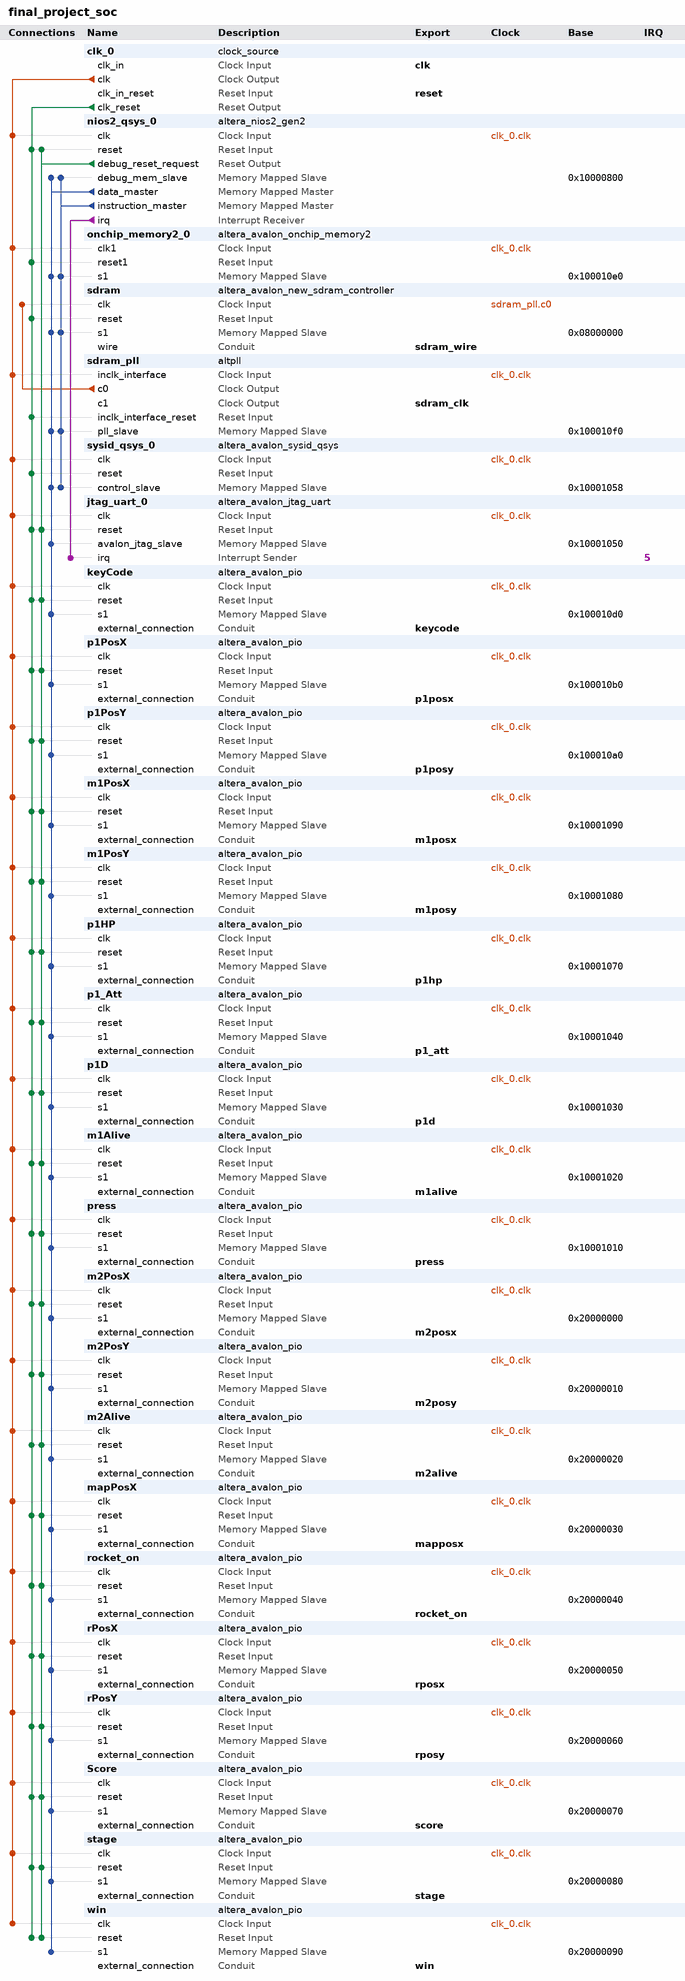
[diagram p0: system contents]
# Platform Designer (Qsys) system final_project_soc, Cyclone IV E EP4CE115F29C7
# Parameters at their usual value, and those the tool derives, are not listed.
package require -exact qsys 15.0
create_system final_project_soc
set_project_property DEVICE_FAMILY {Cyclone IV E}
set_project_property DEVICE EP4CE115F29C7

add_instance clk_0 clock_source 15.0
set_instance_parameter_value clk_0 clockFrequency 50000000

add_instance nios2_qsys_0 altera_nios2_gen2 15.0
set_instance_parameter_value nios2_qsys_0 dcache_size 2048
set_instance_parameter_value nios2_qsys_0 exceptionSlave sdram.s1
set_instance_parameter_value nios2_qsys_0 icache_size 4096
set_instance_parameter_value nios2_qsys_0 impl Tiny
set_instance_parameter_value nios2_qsys_0 resetSlave sdram.s1

add_instance onchip_memory2_0 altera_avalon_onchip_memory2 15.0
set_instance_parameter_value onchip_memory2_0 dataWidth 32
set_instance_parameter_value onchip_memory2_0 dualPort false
set_instance_parameter_value onchip_memory2_0 initMemContent true
set_instance_parameter_value onchip_memory2_0 initializationFileName onchip_mem.hex
set_instance_parameter_value onchip_memory2_0 memorySize 16

add_instance sdram altera_avalon_new_sdram_controller 15.0
set_instance_parameter_value sdram TAC 5.5
set_instance_parameter_value sdram TRCD 20.0
set_instance_parameter_value sdram TRP 20.0
set_instance_parameter_value sdram casLatency 3
set_instance_parameter_value sdram columnWidth 10
set_instance_parameter_value sdram dataWidth 32
set_instance_parameter_value sdram generateSimulationModel false
set_instance_parameter_value sdram model single_Micron_MT48LC4M32B2_7_chip
set_instance_parameter_value sdram numberOfBanks 4
set_instance_parameter_value sdram numberOfChipSelects 1
set_instance_parameter_value sdram powerUpDelay 200.0
set_instance_parameter_value sdram refreshPeriod 7.8125
set_instance_parameter_value sdram rowWidth 13

add_instance sdram_pll altpll 15.0
set_instance_parameter_value sdram_pll CLK0_DIVIDE_BY 1
set_instance_parameter_value sdram_pll CLK0_MULTIPLY_BY 1
set_instance_parameter_value sdram_pll CLK1_DIVIDE_BY 1
set_instance_parameter_value sdram_pll CLK1_DUTY_CYCLE 50
set_instance_parameter_value sdram_pll CLK1_MULTIPLY_BY 1
set_instance_parameter_value sdram_pll CLK1_PHASE_SHIFT -3000
set_instance_parameter_value sdram_pll INCLK0_INPUT_FREQUENCY 20000
set_instance_parameter_value sdram_pll PORT_ARESET PORT_UNUSED
set_instance_parameter_value sdram_pll PORT_LOCKED PORT_UNUSED
set_instance_parameter_value sdram_pll PORT_clk1 PORT_USED
set_instance_parameter_value sdram_pll PORT_clk2 PORT_UNUSED
set_instance_parameter_value sdram_pll PORT_clk3 PORT_UNUSED

add_instance sysid_qsys_0 altera_avalon_sysid_qsys 15.0
set_instance_parameter_value sysid_qsys_0 id 0

add_instance jtag_uart_0 altera_avalon_jtag_uart 15.0
set_instance_parameter_value jtag_uart_0 simInteractiveOptions NO_INTERACTIVE_WINDOWS

add_instance keyCode altera_avalon_pio 15.0
set_instance_parameter_value keyCode direction Input
set_instance_parameter_value keyCode width 8

add_instance p1PosX altera_avalon_pio 15.0
set_instance_parameter_value p1PosX direction Output
set_instance_parameter_value p1PosX width 12

add_instance p1PosY altera_avalon_pio 15.0
set_instance_parameter_value p1PosY direction Output
set_instance_parameter_value p1PosY width 10

add_instance m1PosX altera_avalon_pio 15.0
set_instance_parameter_value m1PosX direction Output
set_instance_parameter_value m1PosX width 12

add_instance m1PosY altera_avalon_pio 15.0
set_instance_parameter_value m1PosY direction Output
set_instance_parameter_value m1PosY width 10

add_instance p1HP altera_avalon_pio 15.0
set_instance_parameter_value p1HP direction Output
set_instance_parameter_value p1HP width 3

add_instance p1_Att altera_avalon_pio 15.0
set_instance_parameter_value p1_Att direction Output
set_instance_parameter_value p1_Att width 1

add_instance p1D altera_avalon_pio 15.0
set_instance_parameter_value p1D direction Output
set_instance_parameter_value p1D width 1

add_instance m1Alive altera_avalon_pio 15.0
set_instance_parameter_value m1Alive direction Output
set_instance_parameter_value m1Alive width 1

add_instance press altera_avalon_pio 15.0
set_instance_parameter_value press direction Input
set_instance_parameter_value press width 1

add_instance m2PosX altera_avalon_pio 15.0
set_instance_parameter_value m2PosX direction Output
set_instance_parameter_value m2PosX width 12

add_instance m2PosY altera_avalon_pio 15.0
set_instance_parameter_value m2PosY direction Output
set_instance_parameter_value m2PosY width 10

add_instance m2Alive altera_avalon_pio 15.0
set_instance_parameter_value m2Alive direction Output
set_instance_parameter_value m2Alive width 1

add_instance mapPosX altera_avalon_pio 15.0
set_instance_parameter_value mapPosX direction Output
set_instance_parameter_value mapPosX width 12

add_instance rocket_on altera_avalon_pio 15.0
set_instance_parameter_value rocket_on direction Output
set_instance_parameter_value rocket_on width 1

add_instance rPosX altera_avalon_pio 15.0
set_instance_parameter_value rPosX direction Output
set_instance_parameter_value rPosX width 12

add_instance rPosY altera_avalon_pio 15.0
set_instance_parameter_value rPosY direction Output
set_instance_parameter_value rPosY width 10

add_instance Score altera_avalon_pio 15.0
set_instance_parameter_value Score direction Output
set_instance_parameter_value Score width 5

add_instance stage altera_avalon_pio 15.0
set_instance_parameter_value stage direction Output
set_instance_parameter_value stage width 2

add_instance win altera_avalon_pio 15.0
set_instance_parameter_value win direction Output
set_instance_parameter_value win width 1

# connections
add_connection clk_0.clk jtag_uart_0.clk clock
add_connection clk_0.clk keyCode.clk clock
add_connection clk_0.clk m1Alive.clk clock
add_connection clk_0.clk m1PosX.clk clock
add_connection clk_0.clk m1PosY.clk clock
add_connection clk_0.clk m2Alive.clk clock
add_connection clk_0.clk m2PosX.clk clock
add_connection clk_0.clk m2PosY.clk clock
add_connection clk_0.clk mapPosX.clk clock
add_connection clk_0.clk nios2_qsys_0.clk clock
add_connection clk_0.clk onchip_memory2_0.clk1 clock
add_connection clk_0.clk p1_Att.clk clock
add_connection clk_0.clk p1D.clk clock
add_connection clk_0.clk p1HP.clk clock
add_connection clk_0.clk p1PosX.clk clock
add_connection clk_0.clk p1PosY.clk clock
add_connection clk_0.clk press.clk clock
add_connection clk_0.clk rocket_on.clk clock
add_connection clk_0.clk rPosX.clk clock
add_connection clk_0.clk rPosY.clk clock
add_connection clk_0.clk Score.clk clock
add_connection clk_0.clk sdram_pll.inclk_interface clock
add_connection clk_0.clk stage.clk clock
add_connection clk_0.clk sysid_qsys_0.clk clock
add_connection clk_0.clk win.clk clock
add_connection sdram_pll.c0 sdram.clk clock
add_connection clk_0.clk_reset jtag_uart_0.reset reset
add_connection clk_0.clk_reset keyCode.reset reset
add_connection clk_0.clk_reset m1Alive.reset reset
add_connection clk_0.clk_reset m1PosX.reset reset
add_connection clk_0.clk_reset m1PosY.reset reset
add_connection clk_0.clk_reset m2Alive.reset reset
add_connection clk_0.clk_reset m2PosX.reset reset
add_connection clk_0.clk_reset m2PosY.reset reset
add_connection clk_0.clk_reset mapPosX.reset reset
add_connection clk_0.clk_reset nios2_qsys_0.reset reset
add_connection clk_0.clk_reset onchip_memory2_0.reset1 reset
add_connection clk_0.clk_reset p1_Att.reset reset
add_connection clk_0.clk_reset p1D.reset reset
add_connection clk_0.clk_reset p1HP.reset reset
add_connection clk_0.clk_reset p1PosX.reset reset
add_connection clk_0.clk_reset p1PosY.reset reset
add_connection clk_0.clk_reset press.reset reset
add_connection clk_0.clk_reset rocket_on.reset reset
add_connection clk_0.clk_reset rPosX.reset reset
add_connection clk_0.clk_reset rPosY.reset reset
add_connection clk_0.clk_reset Score.reset reset
add_connection clk_0.clk_reset sdram.reset reset
add_connection clk_0.clk_reset sdram_pll.inclk_interface_reset reset
add_connection clk_0.clk_reset stage.reset reset
add_connection clk_0.clk_reset sysid_qsys_0.reset reset
add_connection clk_0.clk_reset win.reset reset
add_connection nios2_qsys_0.debug_reset_request jtag_uart_0.reset reset
add_connection nios2_qsys_0.debug_reset_request keyCode.reset reset
add_connection nios2_qsys_0.debug_reset_request m1Alive.reset reset
add_connection nios2_qsys_0.debug_reset_request m1PosX.reset reset
add_connection nios2_qsys_0.debug_reset_request m1PosY.reset reset
add_connection nios2_qsys_0.debug_reset_request m2Alive.reset reset
add_connection nios2_qsys_0.debug_reset_request m2PosX.reset reset
add_connection nios2_qsys_0.debug_reset_request m2PosY.reset reset
add_connection nios2_qsys_0.debug_reset_request mapPosX.reset reset
add_connection nios2_qsys_0.debug_reset_request nios2_qsys_0.reset reset
add_connection nios2_qsys_0.debug_reset_request p1_Att.reset reset
add_connection nios2_qsys_0.debug_reset_request p1D.reset reset
add_connection nios2_qsys_0.debug_reset_request p1HP.reset reset
add_connection nios2_qsys_0.debug_reset_request p1PosX.reset reset
add_connection nios2_qsys_0.debug_reset_request p1PosY.reset reset
add_connection nios2_qsys_0.debug_reset_request press.reset reset
add_connection nios2_qsys_0.debug_reset_request rocket_on.reset reset
add_connection nios2_qsys_0.debug_reset_request rPosX.reset reset
add_connection nios2_qsys_0.debug_reset_request rPosY.reset reset
add_connection nios2_qsys_0.debug_reset_request Score.reset reset
add_connection nios2_qsys_0.debug_reset_request stage.reset reset
add_connection nios2_qsys_0.debug_reset_request win.reset reset
add_connection nios2_qsys_0.data_master jtag_uart_0.avalon_jtag_slave avalon
set_connection_parameter_value nios2_qsys_0.data_master/jtag_uart_0.avalon_jtag_slave baseAddress 0x10001050
add_connection nios2_qsys_0.data_master keyCode.s1 avalon
set_connection_parameter_value nios2_qsys_0.data_master/keyCode.s1 baseAddress 0x100010d0
add_connection nios2_qsys_0.data_master m1Alive.s1 avalon
set_connection_parameter_value nios2_qsys_0.data_master/m1Alive.s1 baseAddress 0x10001020
add_connection nios2_qsys_0.data_master m1PosX.s1 avalon
set_connection_parameter_value nios2_qsys_0.data_master/m1PosX.s1 baseAddress 0x10001090
add_connection nios2_qsys_0.data_master m1PosY.s1 avalon
set_connection_parameter_value nios2_qsys_0.data_master/m1PosY.s1 baseAddress 0x10001080
add_connection nios2_qsys_0.data_master m2Alive.s1 avalon
set_connection_parameter_value nios2_qsys_0.data_master/m2Alive.s1 baseAddress 0x20000020
add_connection nios2_qsys_0.data_master m2PosX.s1 avalon
set_connection_parameter_value nios2_qsys_0.data_master/m2PosX.s1 baseAddress 0x20000000
add_connection nios2_qsys_0.data_master m2PosY.s1 avalon
set_connection_parameter_value nios2_qsys_0.data_master/m2PosY.s1 baseAddress 0x20000010
add_connection nios2_qsys_0.data_master mapPosX.s1 avalon
set_connection_parameter_value nios2_qsys_0.data_master/mapPosX.s1 baseAddress 0x20000030
add_connection nios2_qsys_0.data_master nios2_qsys_0.debug_mem_slave avalon
set_connection_parameter_value nios2_qsys_0.data_master/nios2_qsys_0.debug_mem_slave baseAddress 0x10000800
add_connection nios2_qsys_0.data_master onchip_memory2_0.s1 avalon
set_connection_parameter_value nios2_qsys_0.data_master/onchip_memory2_0.s1 baseAddress 0x100010e0
add_connection nios2_qsys_0.data_master p1_Att.s1 avalon
set_connection_parameter_value nios2_qsys_0.data_master/p1_Att.s1 baseAddress 0x10001040
add_connection nios2_qsys_0.data_master p1D.s1 avalon
set_connection_parameter_value nios2_qsys_0.data_master/p1D.s1 baseAddress 0x10001030
add_connection nios2_qsys_0.data_master p1HP.s1 avalon
set_connection_parameter_value nios2_qsys_0.data_master/p1HP.s1 baseAddress 0x10001070
add_connection nios2_qsys_0.data_master p1PosX.s1 avalon
set_connection_parameter_value nios2_qsys_0.data_master/p1PosX.s1 baseAddress 0x100010b0
add_connection nios2_qsys_0.data_master p1PosY.s1 avalon
set_connection_parameter_value nios2_qsys_0.data_master/p1PosY.s1 baseAddress 0x100010a0
add_connection nios2_qsys_0.data_master press.s1 avalon
set_connection_parameter_value nios2_qsys_0.data_master/press.s1 baseAddress 0x10001010
add_connection nios2_qsys_0.data_master rocket_on.s1 avalon
set_connection_parameter_value nios2_qsys_0.data_master/rocket_on.s1 baseAddress 0x20000040
add_connection nios2_qsys_0.data_master rPosX.s1 avalon
set_connection_parameter_value nios2_qsys_0.data_master/rPosX.s1 baseAddress 0x20000050
add_connection nios2_qsys_0.data_master rPosY.s1 avalon
set_connection_parameter_value nios2_qsys_0.data_master/rPosY.s1 baseAddress 0x20000060
add_connection nios2_qsys_0.data_master Score.s1 avalon
set_connection_parameter_value nios2_qsys_0.data_master/Score.s1 baseAddress 0x20000070
add_connection nios2_qsys_0.data_master sdram.s1 avalon
set_connection_parameter_value nios2_qsys_0.data_master/sdram.s1 baseAddress 0x08000000
add_connection nios2_qsys_0.data_master sdram_pll.pll_slave avalon
set_connection_parameter_value nios2_qsys_0.data_master/sdram_pll.pll_slave baseAddress 0x100010f0
add_connection nios2_qsys_0.data_master stage.s1 avalon
set_connection_parameter_value nios2_qsys_0.data_master/stage.s1 baseAddress 0x20000080
add_connection nios2_qsys_0.data_master sysid_qsys_0.control_slave avalon
set_connection_parameter_value nios2_qsys_0.data_master/sysid_qsys_0.control_slave baseAddress 0x10001058
add_connection nios2_qsys_0.data_master win.s1 avalon
set_connection_parameter_value nios2_qsys_0.data_master/win.s1 baseAddress 0x20000090
add_connection nios2_qsys_0.instruction_master nios2_qsys_0.debug_mem_slave avalon
set_connection_parameter_value nios2_qsys_0.instruction_master/nios2_qsys_0.debug_mem_slave baseAddress 0x10000800
add_connection nios2_qsys_0.instruction_master onchip_memory2_0.s1 avalon
set_connection_parameter_value nios2_qsys_0.instruction_master/onchip_memory2_0.s1 baseAddress 0x100010e0
add_connection nios2_qsys_0.instruction_master sdram.s1 avalon
set_connection_parameter_value nios2_qsys_0.instruction_master/sdram.s1 baseAddress 0x08000000
add_connection nios2_qsys_0.instruction_master sdram_pll.pll_slave avalon
set_connection_parameter_value nios2_qsys_0.instruction_master/sdram_pll.pll_slave baseAddress 0x100010f0
add_connection nios2_qsys_0.instruction_master sysid_qsys_0.control_slave avalon
set_connection_parameter_value nios2_qsys_0.instruction_master/sysid_qsys_0.control_slave baseAddress 0x10001058
add_connection nios2_qsys_0.irq jtag_uart_0.irq interrupt
set_connection_parameter_value nios2_qsys_0.irq/jtag_uart_0.irq irqNumber 5

# exported interfaces
add_interface clk clock sink
set_interface_property clk EXPORT_OF clk_0.clk_in
add_interface keycode conduit end
set_interface_property keycode EXPORT_OF keyCode.external_connection
add_interface m1alive conduit end
set_interface_property m1alive EXPORT_OF m1Alive.external_connection
add_interface m1posx conduit end
set_interface_property m1posx EXPORT_OF m1PosX.external_connection
add_interface m1posy conduit end
set_interface_property m1posy EXPORT_OF m1PosY.external_connection
add_interface m2alive conduit end
set_interface_property m2alive EXPORT_OF m2Alive.external_connection
add_interface m2posx conduit end
set_interface_property m2posx EXPORT_OF m2PosX.external_connection
add_interface m2posy conduit end
set_interface_property m2posy EXPORT_OF m2PosY.external_connection
add_interface mapposx conduit end
set_interface_property mapposx EXPORT_OF mapPosX.external_connection
add_interface p1_att conduit end
set_interface_property p1_att EXPORT_OF p1_Att.external_connection
add_interface p1d conduit end
set_interface_property p1d EXPORT_OF p1D.external_connection
add_interface p1hp conduit end
set_interface_property p1hp EXPORT_OF p1HP.external_connection
add_interface p1posx conduit end
set_interface_property p1posx EXPORT_OF p1PosX.external_connection
add_interface p1posy conduit end
set_interface_property p1posy EXPORT_OF p1PosY.external_connection
add_interface press conduit end
set_interface_property press EXPORT_OF press.external_connection
add_interface reset reset sink
set_interface_property reset EXPORT_OF clk_0.clk_in_reset
add_interface rocket_on conduit end
set_interface_property rocket_on EXPORT_OF rocket_on.external_connection
add_interface rposx conduit end
set_interface_property rposx EXPORT_OF rPosX.external_connection
add_interface rposy conduit end
set_interface_property rposy EXPORT_OF rPosY.external_connection
add_interface score conduit end
set_interface_property score EXPORT_OF Score.external_connection
add_interface sdram_clk clock source
set_interface_property sdram_clk EXPORT_OF sdram_pll.c1
add_interface sdram_wire conduit end
set_interface_property sdram_wire EXPORT_OF sdram.wire
add_interface stage conduit end
set_interface_property stage EXPORT_OF stage.external_connection
add_interface win conduit end
set_interface_property win EXPORT_OF win.external_connection

set_interconnect_requirement {$system} qsys_mm.clockCrossingAdapter HANDSHAKE
set_interconnect_requirement {$system} qsys_mm.enableEccProtection FALSE
set_interconnect_requirement {$system} qsys_mm.insertDefaultSlave FALSE
set_interconnect_requirement {$system} qsys_mm.maxAdditionalLatency 1

save_system final_project_soc.qsys
